# EAGLE design TestA (EAGLE 9.6.2)
IGNORE_RENUMBER: TP
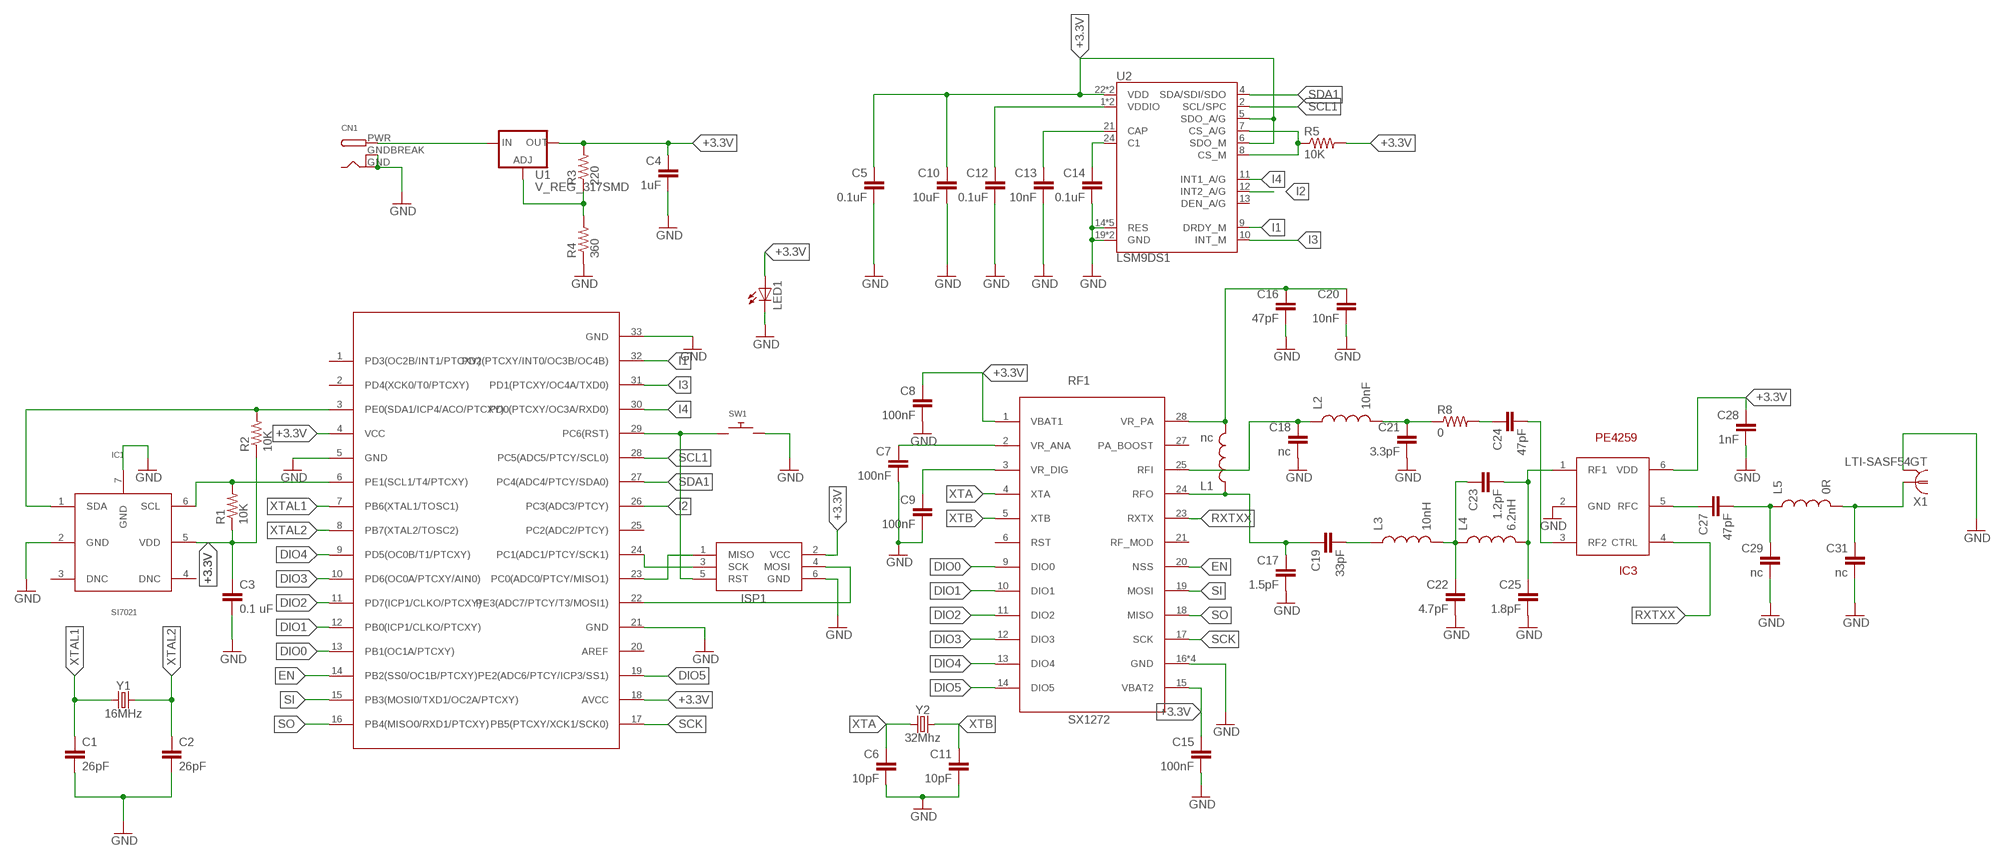
[diagram p0: schematic, sheet 1]

## Parts
C1  26pF  CAP0402-CAP  [0402-CAP]
C2  26pF  CAP0402-CAP  [0402-CAP]
C3  0.1 uF  CAP0402-CAP  [0402-CAP]
C4  1uF  CAP0402-CAP  [0402-CAP]
C5  0.1uF  CAP0402-CAP  [0402-CAP]
C6  10pF  CAP0402-CAP  [0402-CAP]
C7  100nF  CAP0402-CAP  [0402-CAP]
C8  100nF  CAP0402-CAP  [0402-CAP]
C9  100nF  CAP0402-CAP  [0402-CAP]
C10  10uF  CAP0402-CAP  [0402-CAP]
C11  10pF  CAP0402-CAP  [0402-CAP]
C12  0.1uF  CAP0402-CAP  [0402-CAP]
C13  10nF  CAP0402-CAP  [0402-CAP]
C14  0.1uF  CAP0402-CAP  [0402-CAP]
C15  100nF  CAP0402-CAP  [0402-CAP]
C16  47pF  CAP0402-CAP  [0402-CAP]
C17  1.5pF  CAP0402-CAP  [0402-CAP]
C18  nc  CAP0402-CAP  [0402-CAP]
C19  33pF  CAP0402-CAP  [0402-CAP]
C20  10nF  CAP0402-CAP  [0402-CAP]
C21  3.3pF  CAP0402-CAP  [0402-CAP]
C22  4.7pF  CAP0402-CAP  [0402-CAP]
C23  1.2pF  CAP0402-CAP  [0402-CAP]
C24  47pF  CAP0402-CAP  [0402-CAP]
C25  1.8pF  CAP0402-CAP  [0402-CAP]
C27  47pF  CAP0402-CAP  [0402-CAP]
C28  1nF  CAP0402-CAP  [0402-CAP]
C29  nc  CAP0402-CAP  [0402-CAP]
C31  nc  CAP0402-CAP  [0402-CAP]
CN1  DCBARRELPTH  [DCJACK_2MM_PTH]
IC1  SI7021  [SI7021]
IC2  ATMEGA328-PB  [ATMEGA328-PB]
IC3  PE4259  [PE4259]
ISP1  AVRISP-6  [AVRISP]
L1  nc  INDUCTOR0402  [C0402]
L2  10nF  INDUCTOR0402  [C0402]
L3  10nH  INDUCTOR0402  [C0402]
L4  6.2nH  INDUCTOR0402  [C0402]
L5  0R  INDUCTOR0402  [C0402]
LED1  LED3MM  [LED3MM]
R1  10K  RESISTOR0402-RES  [0402-RES]
R2  10K  RESISTOR0402-RES  [0402-RES]
R3  220  RESISTOR0402-RES  [0402-RES]
R4  360  RESISTOR0402-RES  [0402-RES]
R5  10K  RESISTOR0402-RES  [0402-RES]
R8  0  RESISTOR0402-RES  [0402-RES]
RF1  SX1272  [SX1272]
SW1  SWITCH_PUSHBUTTONSOFTTOUCHSMD_SJ  [PUSHBUTTON_SMD_SJ]
U1  V_REG_317SMD  [SOT223]
U2  LSM9DS1  [LGA24-8X4]
X1  LTI-SASF54GT  [LTI-SASF54GT]
Y1  16MHz  CRYSTAL-16MHZSMD-2X1.6  [CRYSTAL-SMD-2.0X1.6MM]
Y2  32Mhz  CRYSTAL-16MHZSMD-2X1.6  [CRYSTAL-SMD-2.0X1.6MM]

## Nets
+3.3V: C3.1 C4.1 C5.1 C8.1 C10.1 C15.1 C28.1 IC1.5(VDD) IC2.4(VCC) IC2.18(AVCC) IC3.6(VDD) ISP1.2(VCC) LED1.A R1.1 R2.1 R3.2 R5.2 RF1.1(VBAT1) RF1.15(VBAT2) U1.2(OUT) U2.5(SDO_A/G) U2.6(SDO_M) U2.22(VDD) U2.23(VDD)
DIO0: IC2.13(PB1(OC1A/PTCXY)) RF1.9(DIO0)
DIO1: IC2.12(PB0(ICP1/CLKO/PTCXY)) RF1.10(DIO1)
DIO2: IC2.11(PD7(ICP1/CLKO/PTCXY)) RF1.11(DIO2)
DIO3: IC2.10(PD6(OC0A/PTCXY/AIN0)) RF1.12(DIO3)
DIO4: IC2.9(PD5(OC0B/T1/PTCXY)) RF1.13(DIO4)
DIO5: IC2.19(PE2(ADC6/PTCY/ICP3/SS1)) RF1.14(DIO5)
EN: IC2.14(PB2(SS0/OC1B/PTCXY)) RF1.20(NSS)
GND: C1.2 C2.2 C3.2 C4.2 C5.2 C6.2 C7.2 C8.2 C9.2 C10.2 C11.2 C12.2 C13.2 C14.2 C15.2 C16.2 C17.2 C18.2 C20.2 C21.2 C22.2 C25.2 C28.2 C29.2 C31.2 CN1.GND CN1.GNDBREAK IC1.2(GND) IC1.7(GND) IC2.5(GND) IC2.21(GND) IC2.33(GND) IC3.2(GND) ISP1.6(GND) LED1.K(C) R4.1 RF1.16(GND) RF1.22(GND) RF1.26(GND) RF1.29(GND) SW1.P$2 U2.14(RES) U2.15(RES) U2.16(RES) U2.17(RES) U2.18(RES) U2.19(GND) U2.20(GND) X1.2 X1.3 X1.4 X1.5
I1: IC2.32(PD2(PTCXY/INT0/OC3B/OC4B)) U2.9(DRDY_M)
I2: IC2.26(PC3(ADC3/PTCY)) U2.12(INT2_A/G)
I3: IC2.31(PD1(PTCXY/OC4A/TXD0)) U2.10(INT_M)
I4: IC2.30(PD0(PTCXY/OC3A/RXD0)) U2.11(INT1_A/G)
N$1: C24.1 R8.2
N$2: C16.1 C20.1 L1.2 RF1.28(VR_PA)
N$3: CN1.PWR U1.3(IN)
N$4: C24.2 IC3.3(RF2)
N$5: R5.1 U2.7(CS_A/G) U2.8(CS_M)
N$6: R3.1 R4.2 U1.1(ADJ)
N$7: C18.1 L2.1 RF1.25(RFI)
N$8: C13.1 U2.21(CAP)
N$9: C12.1 U2.1(VDDIO) U2.3(VDDIO)
N$10: C21.1 L2.2 R8.1
N$11: C17.1 C19.1 L1.1 RF1.24(RFO)
N$12: C22.1 C23.1 L3.2 L4.1
N$13: C19.2 L3.1
N$14: C23.2 C25.1 IC3.1(RF1) L4.2
N$15: C31.1 L5.2 X1.1
N$16: C27.1 IC3.5(RFC)
N$17: C14.1 U2.24(C1)
N$18: C27.2 C29.1 L5.1
N$22: IC2.29(PC6(RST)) ISP1.5(RST) SW1.P$1
N$23: IC2.24(PC1(ADC1/PTCY/SCK1)) ISP1.3(SCK)
N$24: C7.1 RF1.2(VR_ANA)
N$25: C9.1 RF1.3(VR_DIG)
N$26: IC2.23(PC0(ADC0/PTCY/MISO1)) ISP1.1(MISO)
N$27: IC2.22(PE3(ADC7/PTCY/T3/MOSI1)) ISP1.4(MOSI)
RXTXX: IC3.4(CTRL) RF1.23(RXTX)
SCK: IC2.17(PB5(PTCXY/XCK1/SCK0)) RF1.17(SCK)
SCL: IC1.6(SCL) IC2.6(PE1(SCL1/T4/PTCXY)) R1.2
SCL1: IC2.28(PC5(ADC5/PTCY/SCL0)) U2.2(SCL/SPC)
SDA: IC1.1(SDA) IC2.3(PE0(SDA1/ICP4/ACO/PTCXY)) R2.2
SDA1: IC2.27(PC4(ADC4/PTCY/SDA0)) U2.4(SDA/SDI/SDO)
SI: IC2.15(PB3(MOSI0/TXD1/OC2A/PTCXY)) RF1.19(MOSI)
SO: IC2.16(PB4(MISO0/RXD1/PTCXY)) RF1.18(MISO)
XTA: C6.1 RF1.4(XTA) Y2.1
XTAL1: C1.1 IC2.7(PB6(XTAL1/TOSC1)) Y1.1
XTAL2: C2.1 IC2.8(PB7(XTAL2/TOSC2)) Y1.3
XTB: C11.1 RF1.5(XTB) Y2.3
Unconnected: IC1.3(DNC) IC1.4(DNC) IC2.1(PD3(OC2B/INT1/PTCXY)) IC2.2(PD4(XCK0/T0/PTCXY)) IC2.20(AREF) IC2.25(PC2(ADC2/PTCY)) RF1.6(RST) RF1.21(RF_MOD) RF1.27(PA_BOOST) U2.13(DEN_A/G)

## Library data of the parts
C1-C25 C27-C29 C31 = SparkFun:CAP: Capacitor Standard 0603 ceramic capacitor, and 0.1" leaded capacitor.
CN1 = adafruit:DCBARREL: 2.0mm DC Barrel Jack DCJACK_2MM_PTH - Through Hole Jack (4UConnector: 05537)
IC1 = Mini-Project:SI7021
IC2 = Mini-Project:ATMEGA328-PB
IC3 = Mini-Project:PE4259
ISP1 = adafruit:AVRISP: AVR ISP HEADER Standard 6 pin header for AVR programming
L1-L5 = SparkFun:INDUCTOR: Inductors Basic Inductor/Choke - 0603 and 1206. Footprints are not proven and vary greatly between part numbers.
LED1 = adafruit:LED: LED OSRAM: - CHIPLED LG R971, LG N971, LY N971, LG Q971, LY Q971, LO R971, LY R971 LH N974, LH R974 LS Q976, LO Q976, LY Q976 LO Q996 - Hyper CHIPLED LW Q18S LB Q993, LB Q99A, LB R99A - SideLED LS A670, LO A670, LY A670, LG A670, LP A670 LB A673, LV A673, LT A673, LW A673 LH A674 LY A675 LS A676, LA A676, LO A676, LY A676, LW A676 LS A679, LY A679, LG A679 - Hyper Micro SIDELED® LS Y876, LA Y876, LO Y876, LY Y876 LT Y87S - SmartLED LW L88C, LW L88S LB L89C, LB L89S, LG L890 LS L89K, LO L89K, LY L89K LS L896, LA L896, LO L896, LY L896 - TOPLED LS T670, LO T670, LY T670, LG T670, LP T670 LSG T670, LSP T670, LSY T670, LOP T670, LYG T670 LG T671, LOG T671, LSG T671 LB T673, LV T673, LT T673, LW T673 LH T674 LS T676, LA T676, LO T676, LY T676, LB T676, LH T676, LSB T676, LW T676 LB T67C, LV T67C, LT T67C, LS T67K, LO T67K, LY T67K, LW E67C LS E67B, LA E67B, LO E67B, LY E67B, LB E67C, LV E67C, LT E67C LW T67C LS T679, LY T679, LG T679 LS T770, LO T770, LY T770, LG T770, LP T770 LB T773, LV T773, LT T773, LW T773 LH T774 LS E675, LA E675, LY E675, LS T675 LS T776, LA T776, LO T776, LY T776, LB T776 LHGB T686 LT T68C, LB T68C - Hyper Mini TOPLED® LB M676 - Mini TOPLED Santana® LG M470 LS M47K, LO M47K, LY M47K Source: http://www.osram.convergy.de/
R1-R5 R8 = SparkFun:RESISTOR: Resistor Basic schematic elements and footprints for 0603, 1206, and PTH resistors.
RF1 = Mini-Project:SX1272
SW1 = adafruit:SWITCH_PUSHBUTTON: Buttons SOFTTOUCHSMD_SJ - Soft touch temporary push button (Super Junk Akihabara) Compatible with SKPMANE010 [Mouser: 688-SKPMAN] C&K_KSS = Digikey: KSS221GLFS
U1 = SparkFun:V_REG_317: Voltage Regulator Standard LM317 adjustable voltage regulator. AOI (Adjust Output Input). Google 'LM317 Calculator' for easy to use app to get the two resistor values needed. 240/720 for 5V output. 240/390 for 3.3V output. Spark Fun Electronics SKU : COM-00527
U2 = LSM9DS1:LSM9DS1: LSM9DS1 3D accelerometer, gyroscope & magnetometer The LSM9DS1 is a system-in-package featuring a 3D digital linear acceleration sensor, a 3D digital angular rate sensor, and a 3D digital magnetic sensor. The LSM9DS1 has a linear acceleration full scale of ±2g/±4g/±8/±16 g, a magnetic field full scale of ±4/±8/±12/±16 gauss and an angular rate of ±245/±500/±2000 dps. The LSM9DS1 includes an I2 C serial bus interface supporting standard and fast mode (100 kHz and 400 kHz) and an SPI serial standard interface. Magnetic, accelerometer and gyroscope sensing can be enabled or set in power-down mode separately for smart power management. The LSM9DS1 is available in a plastic land grid array package (LGA) and it is guaranteed to operate over an extended temperature range from -40 °C to +85 °C.; PROD_ID: IC-12536
X1 = con-coax:LTI-SASF54GT: SMA vertical PCB thrue hole jack Source: Lighthorse Technologies, inc. SASF54GT.pdf; OC_FARNELL: unknown; OC_NEWARK: unknown
Y1 = SparkFun-Clocks:CRYSTAL-16MHZ: 16MHz Crystal Digikey Example <http://www.digikey.com/product-search/en?keywords=535-9122-1-ND> Frequency: 16MHz Frequency Stability: ±50ppm Frequency Tolerance: ±20ppm Load Capacitance: 18pF SparkFun Products: Pro Micro -5V/16MHz <https://www.sparkfun.com/products/12640> SparkFun Serial Enabled LCD Kit <https://www.sparkfun.com/products/10097>; PROD_ID: XTAL-14681
Y2 = SparkFun-Clocks:CRYSTAL-16MHZ: 16MHz Crystal Digikey Example <http://www.digikey.com/product-search/en?keywords=535-9122-1-ND> Frequency: 16MHz Frequency Stability: ±50ppm Frequency Tolerance: ±20ppm Load Capacitance: 18pF SparkFun Products: Pro Micro -5V/16MHz <https://www.sparkfun.com/products/12640> SparkFun Serial Enabled LCD Kit <https://www.sparkfun.com/products/10097>; PROD_ID: XTAL-14681; VALUE: 16MHz

## Board
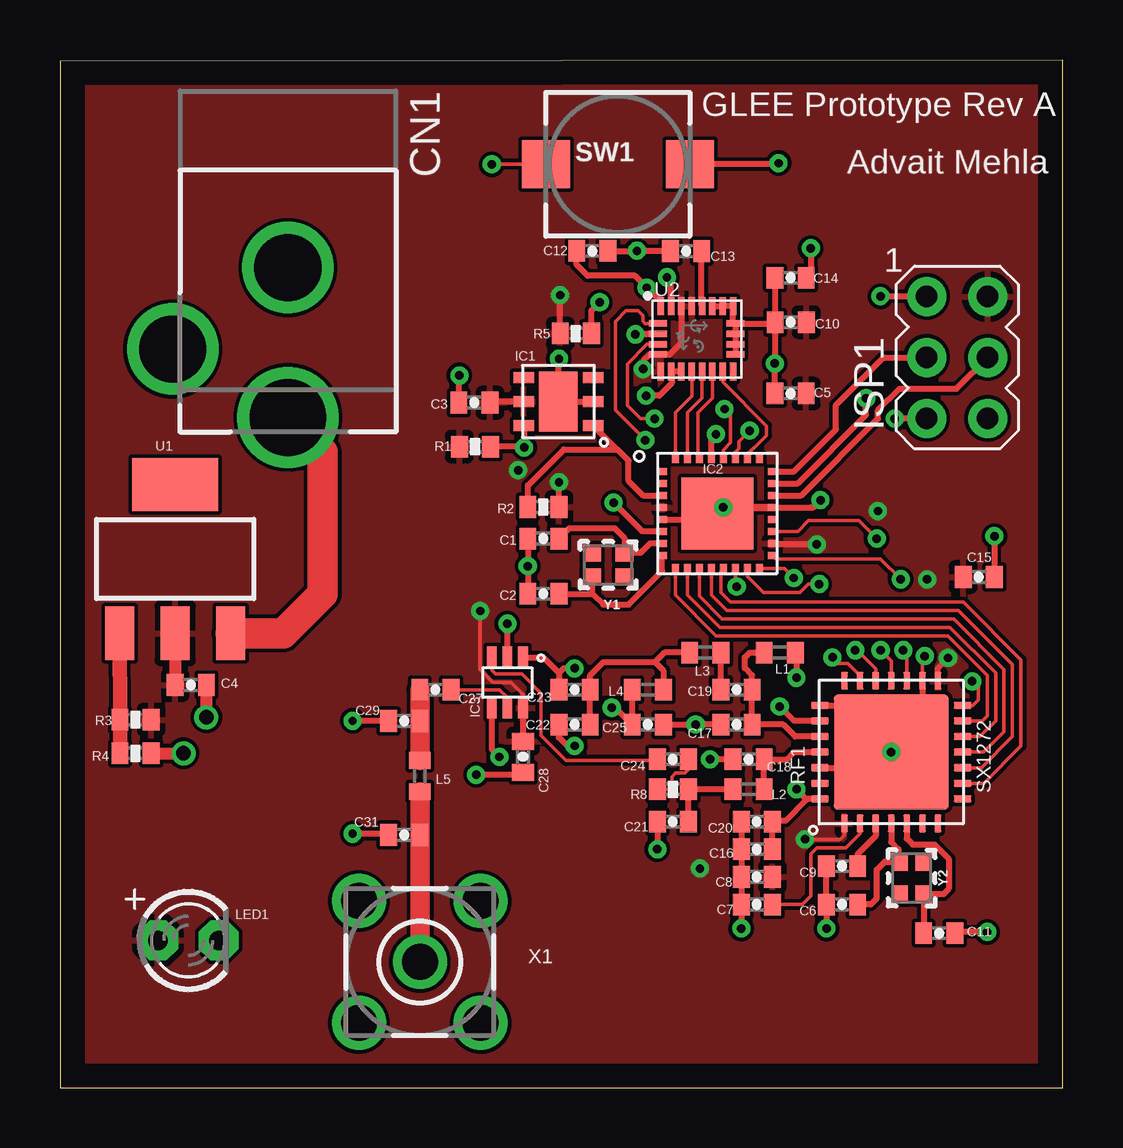
[diagram p1: board, top side]
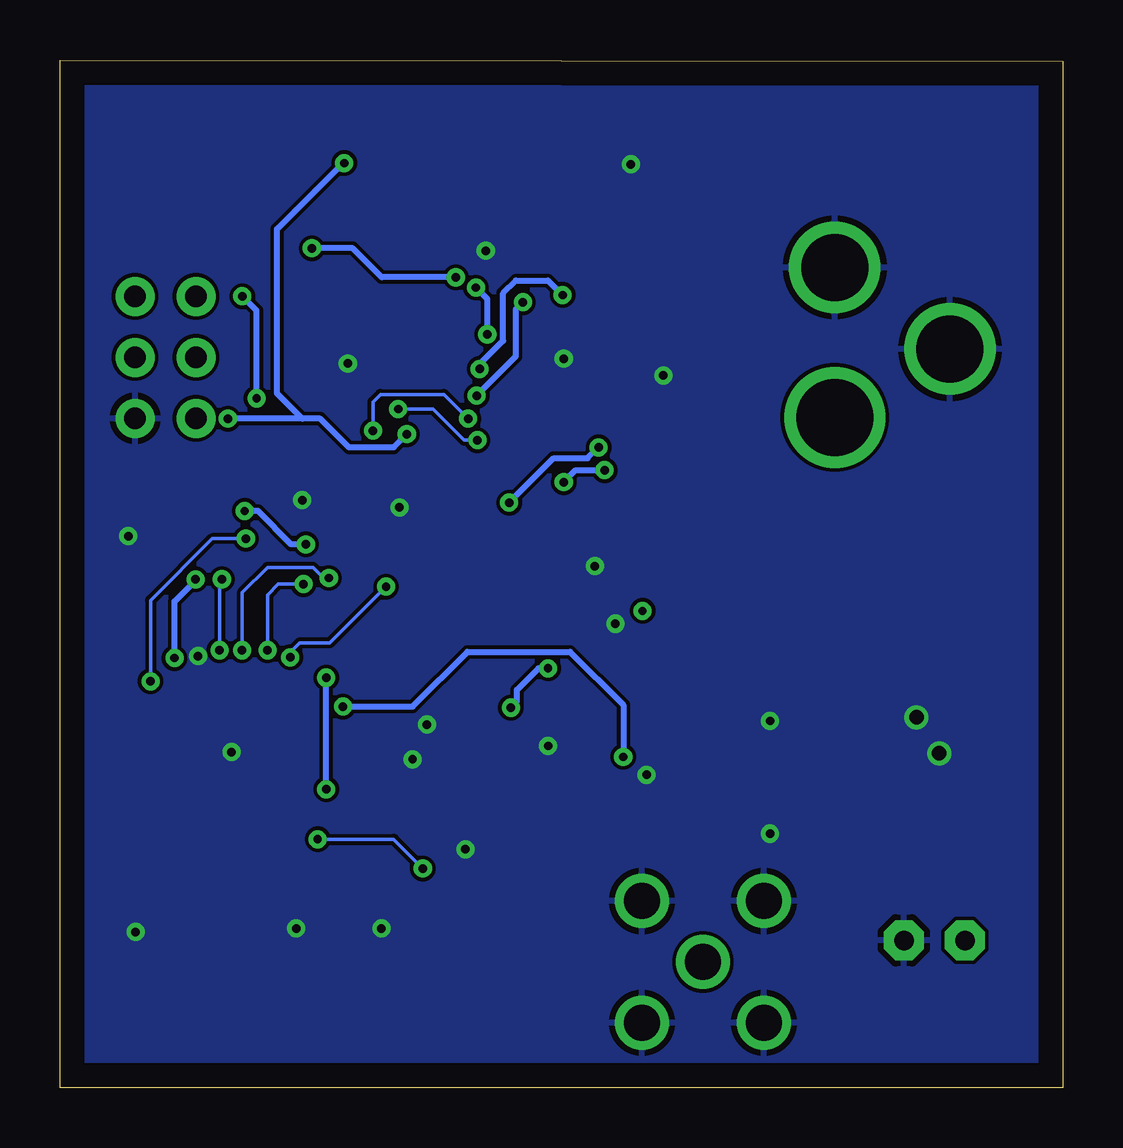
[diagram p2: board, bottom side, seen from below]

Size 41.8 x 42.85 mm. Coordinates in mm from the lower left corner, seen from the top.
Outline: 0,0 41.8,0 41.8,42.85 0,42.8 0,0
Copper layers (1*16): Top 0.035mm / dielectric 1.5mm / Bottom 0.035mm
Design rules "default": minimum track width 6mil, minimum drill 0.35mm, track to track 6mil, track to pad 6mil, pad to pad 6mil, via to via 6mil, smd to smd 6mil, copper to edge 40mil, drill to drill 6mil, minimum pad ring 10mil, minimum via ring 8mil, stop-mask expansion 4mil, vias tented up to drill 0mil, thermal gap 10mil

### Footprints (pad centres in the part's own frame; a part is rotated, then mirrored left to right if it is on the bottom)
0402-CAP = smd 0.7 x 0.9: 1 -0.65,0; 2 0.65,0
DCJACK_2MM_PTH = drill 2.8: GND 0,7.35; GNDBREAK 4.8,10.75 | drill 3.2: PWR 0,13.6
SI7021 = smd 0.85 x 0.45: 1 -1.45,1; 2 -1.45,0; 3 -1.45,-1; 4 1.45,-1; 5 1.45,0; 6 1.45,1 | smd 1.6 x 2.5: 7 0,0
ATMEGA328-PB = smd 0.4 x 0.3: 1 -2.3,1.75; 2 -2.3,1.25; 3 -2.3,0.75; 4 -2.3,0.25; 5 -2.3,-0.25; 6 -2.3,-0.75; 7 -2.3,-1.25; 8 -2.3,-1.75; 17 2.3,-1.75; 18 2.3,-1.25; 19 2.3,-0.75; 20 2.3,-0.25; 21 2.3,0.25; 22 2.3,0.75; 23 2.3,1.25; 24 2.3,1.75 | smd 0.3 x 0.4: 9 -1.75,-2.3; 10 -1.25,-2.3; 11 -0.75,-2.3; 12 -0.25,-2.3; 13 0.25,-2.3; 14 0.75,-2.3; 15 1.25,-2.3; 16 1.75,-2.3; 25 1.75,2.3; 26 1.25,2.3; 27 0.75,2.3; 28 0.25,2.3; 29 -0.25,2.3; 30 -0.75,2.3; 31 -1.25,2.3; 32 -1.75,2.3 | smd 3 x 3: 33 0,0
PE4259 = smd 0.4 x 0.9: 1 -0.65,-1.05; 2 0,-1.05; 3 0.65,-1.05; 4 0.65,1.05; 5 0,1.05; 6 -0.65,1.05
AVRISP = drill 0.9 pad 1.626: 1 -1.27,2.54; 2 1.27,2.54; 3 -1.27,0; 4 1.27,0; 5 -1.27,-2.54; 6 1.27,-2.54
C0402 = smd 0.7 x 0.9: 1 -0.65,0; 2 0.65,0
LED3MM = drill 0.813 pad 1.676 octagon: A -1.27,0; K 1.27,0
0402-RES = smd 0.7 x 0.9: 1 -0.65,0; 2 0.65,0
SX1272 = smd 0.75 x 0.3: 1 -2.975,1.95; 2 -2.975,1.3; 3 -2.975,0.65; 4 -2.975,0; 5 -2.975,-0.65; 6 -2.975,-1.3; 7 -2.975,-1.95; 15 2.975,-1.95; 16 2.975,-1.3; 17 2.975,-0.65; 18 2.975,0; 19 2.975,0.65; 20 2.975,1.3; 21 2.975,1.95 | smd 0.3 x 0.75: 8 -1.95,-2.975; 9 -1.3,-2.975; 10 -0.65,-2.975; 11 0,-2.975; 12 0.65,-2.975; 13 1.3,-2.975; 14 1.95,-2.975; 22 1.95,2.975; 23 1.3,2.975; 24 0.65,2.975; 25 0,2.975; 26 -0.65,2.975; 27 -1.3,2.975; 28 -1.95,2.975 | smd 4.8 x 4.8: 29 0,0
PUSHBUTTON_SMD_SJ = smd 2 x 2: P$1 3,0; P$2 -3,0
SOT223 = smd 1.219 x 2.235: 1 -2.311,-3.099; 2 0,-3.099; 3 2.311,-3.099 | smd 3.6 x 2.2: 4 0,3.099
LGA24-8X4 = smd 0.27 x 0.75: 1 -1.505,1.365; 6 -1.505,-1.365; 7 -1.075,-1.365; 8 -0.645,-1.365; 9 -0.215,-1.365; 10 0.215,-1.365; 11 0.645,-1.365; 12 1.075,-1.365; 13 1.505,-1.365; 18 1.505,1.365; 19 1.075,1.365; 20 0.645,1.365; 21 0.215,1.365; 22 -0.215,1.365; 23 -0.645,1.365; 24 -1.075,1.365 | smd 0.75 x 0.27: 2 -1.615,0.645; 3 -1.615,0.215; 4 -1.615,-0.215; 5 -1.615,-0.645; 14 1.615,-0.645; 15 1.615,-0.215; 16 1.615,0.215; 17 1.615,0.645
LTI-SASF54GT = drill 1.5 pad 2.2: 1 0,0; 2 -2.54,2.54; 3 2.54,2.54; 4 2.54,-2.54; 5 -2.54,-2.54
CRYSTAL-SMD-2.0X1.6MM = smd 0.75 x 0.7: 1 -0.675,-0.5; 2 0.675,-0.5; 3 0.675,0.5; 4 -0.675,0.5

### Placement (x,y rotation side)
C1  20.15,22.9 180 top
C2  20.15,20.6 180 top
C3  17.27,28.57 180 top
C4  5.45,16.8 0 top
C5  30.45,28.95 180 top
C6  32.6,7.65 180 top
C7  29.05,7.65 180 top
C8  29.05,8.8 180 top
C9  32.6,9.25 180 top
C10  30.46,31.91 180 top
C11  36.65,6.45 0 top
C12  22.19,34.89 0 top
C13  26.1,34.88 180 top
C14  30.45,33.77 180 top
C15  38.3,21.3 0 top
C16  29.05,9.95 180 top
C17  28.2,15.15 180 top
C18  28.7,13.7 180 top
C19  28.2,16.6 180 top
C20  29.05,11.1 180 top
C21  25.55,11.1 180 top
C22  21.45,15.15 180 top
C23  21.45,16.6 180 top
C24  25.55,13.7 180 top
C25  24.5,15.15 0 top
C27  15.65,16.6 180 top
C28  19.3,13.8 270 top
C29  14.35,15.3 180 top
C31  14.35,10.55 180 top
CN1  9.5,41.55 180 top
IC1  20.77,28.61 180 top
IC2  27.4,23.95 0 top
IC3  18.65,16.9 180 top
ISP1  37.4,30.45 0 top
L1  30,18.15 0 top
L2  28.7,12.45 180 top
L3  26.9,18.15 180 top
L4  24.5,16.6 180 top
L5  15,13 270 top
LED1  5.35,6.15 0 top
R1  17.3,26.73 0 top
R2  20.15,24.21 180 top
R3  3.15,15.35 0 top
R4  3.15,13.95 180 top
R5  21.5,31.45 180 top
R8  25.55,12.45 180 top
RF1  34.65,14 90 top
SW1  23.25,38.5 0 top
U1  4.8,22.05 0 top
U2  26.55,31.22 0 top
X1  15,5.25 0 top
Y1  22.85,21.8 180 top
Y2  35.5,8.75 270 top

### Tracks (layer width: path | path; a pad name or v marks a point on that pad's centre or on a via)
+3.3V  (via drill 0.35)
  Top 0.152: IC3.6 19.3,16.4 18.8,16.91 18.05,16.91 17.52,17.44 v17.52,19.88 | IC2.18 29.74,22.66 | RF1.1 32.7,10.53 32.54,10.37 v31.06,10.37
  Top 0.254: v24.3,29.97 24.3,30.3 24.59,30.57 U2.5 25.4,30.57 25.91,31.07 U2.23 | IC1.5 17.97,28.61 C3.1 | R2.1 v20.8,25.25 | v37.02,17.92 36.6,17.5 RF1.15 | IC3.6 C28.1 | v31.55,22.66 29.74,22.66 | R5.2 v20.85,33.05
  Top 0.508: U1.2 C4.1
  Bottom 0.152: v31.06,10.37 27.89,10.37 v26.68,9.15
  Bottom 0.254: v24.3,29.97 24.3,30.16 23.33,31.14 23.33,33.12 22.79,33.66 21.46,33.66 v20.85,33.05 | v20.8,25.25 20.3,25.75 v19.1,25.75 | v37.02,17.92 37.02,20.28 36.12,21.18 v36.15,21.2 | v31.55,22.66 32.16,22.66 33.55,24.05 v34.1,24.05
  pour Top: 0.4,42.55 41.65,42.55 41.65,0.48 24,0.45 14.06,0.47 0.4,0.47
DIO0
  Top 0.152: IC2.13 27.55,21.55 27.55,20.65 27.95,20.25 37.65,20.25 40.05,17.84 40.05,14.26 38.5,12.7 RF1.9
DIO1
  Top 0.152: IC2.12 27.15,20.55 27.8,19.9 37.45,19.9 39.7,17.65 39.7,14.65 38.4,13.35 RF1.10
DIO2
  Top 0.152: IC2.11 26.65,20.5 27.6,19.55 37.25,19.55 39.35,17.45 39.35,14.85 38.5,14 RF1.11
DIO3
  Top 0.152: IC2.10 26.15,20.55 27.5,19.2 37.1,19.2 39,17.3 39,15.3 38.35,14.65 RF1.12
DIO4
  Top 0.152: IC2.9 25.65,20.55 27.35,18.85 37,18.85 38.65,17.2 38.65,15.5 38.45,15.3 RF1.13
DIO5  (via drill 0.35)
  Top 0.152: IC2.19 30.75,23.2 31.2,23.65 33.3,23.65 v34.05,22.9 | v38.02,16.95 38.27,16.7 38.27,16.18 38.05,15.95 RF1.14
  Bottom 0.152: v38.02,16.95 38.02,20.32 35.45,22.9 v34.05,22.9
EN  (via drill 0.35)
  Top 0.152: IC2.14 28.15,20.96 v28.21,20.9 | v32.2,17.95 32.45,17.7 32.85,17.7 33.35,17.2 RF1.20
  Bottom 0.152: v28.21,20.9 30.56,18.55 31.8,18.55 32.2,18.15 v32.2,17.95
GND  (via drill 0.35, 0.6)
  Top 0.152: RF1.16 35.95,17.91 v36.05,18 | C28.2 19.2,13.05 | 35.95,15.3 RF1.29 | SW1.P$2 v18,38.5
  Top 0.254: U2.14 U2.15 U2.16 U2.17 | IC2.21 31.29,24.2 31.4,24.2 v31.7,24.5 | IC1.2 IC1.7 20.77,30.38 v20.8,30.4 | C3.2 16.62,29.68 v16.65,29.7 | U2.20 U2.19 U2.18 28.05,31.98 U2.17 | v19.5,21.75 C1.2 C2.2 | C9.2 C6.2 v31.95,6.65 | v28.4,6.65 C7.2 C8.2 C16.2 C20.2 | C18.2 v27.1,13.7 | C21.2 v24.9,9.95 | C17.2 v26.5,15.15 C25.2 | v38.65,6.5 37.35,6.5 C11.2 | IC3.2 v18.65,19.35 | 19.2,13.05 v17.35,13.05 | RF1.26 34,13.35 RF1.29 32.7,15.95 RF1.22 | RF1.16 35.95,15.3 | 29.75,29 C5.2 v29.8,30.2 v29.81,30.21 C10.2 | C12.2 v24.04,34.89 | v24.04,34.89 v24.05,34.9 | C13.2 24.05,34.88 v24.04,34.89 | C10.2 29.85,31.95 29.8,32.01 C14.2 | v21.45,14.26 21.15,14.26 20.8,14.61 C22.2 | v38.95,23 C15.2 | IC2.5 27.15,23.7 v27.65,24.2 | U2.17 29.76,31.86 C10.2 | C29.2 v12.2,15.3 | C31.2 13.65,10.6 v12.2,10.6
  Top 0.305: IC2.21 v27.65,24.2 IC2.33
  Top 0.508: R4.1 v5.15,13.95 | C4.2 v6.1,15.45
  other vias: 34.65,14
  pour Bottom: 0.4,42.6 41.65,42.6 41.65,0.5 23.7,0.45 0.4,0.5
I1
  Top 0.152: IC2.32 25.65,28.15 26.34,28.84 U2.9
I2
  Top 0.152: U2.12 27.62,29.43 29.45,27.6 29.45,27.2 28.93,26.68 28.91,26.68 28.65,26.42 IC2.26
I3
  Top 0.152: IC2.31 26.15,28.15 26.76,28.76 U2.10
I4
  Top 0.152: IC2.30 26.6,26.3 26.6,28.15 27.2,28.75 U2.11
N$1
  Top 0.152: R8.2 25.35,12.45 25.5,12.6 25.5,12.97 25.66,13.13 26.05,13.13 26.2,13.28 C24.1
N$2  (via drill 0.35)
  Top 0.152: L1.2 30.7,18.1
  Top 0.254: C16.1 C20.1 29.75,11.15 30.25,11.15 31.1,12 31.1,12.05 | RF1.28 31.1,12.05 | 31.1,12.05 v30.7,12.45 | 30.7,18.1 v30.7,17.1
  Bottom 0.254: v30.7,12.45 v30.7,17.1
N$3
  Top 1.27: CN1.PWR 10.95,26.5 10.95,20.59 9.31,18.95 U1.3
N$4
  Top 0.152: C24.2 24.85,13.65 21.1,13.65 20.05,14.7 20.05,16.45 19.25,17.25 18.15,17.25 18,17.4 IC3.3
N$5  (via drill 0.35 pad 0.55)
  Top 0.152: U2.7 25.51,29.82
  Top 0.254: U2.8 U2.7 | 25.51,29.82 25.51,29.39 24.98,28.86 v24.43,28.86 | R5.1 22.15,32.4 v22.5,32.75
  Bottom 0.254: v24.43,28.86 22.8,30.49 22.8,32.45 v22.5,32.75
N$6
  Top 0.61: U1.1 | U1.1 R3.1 R4.2
N$7
  Top 0.254: RF1.25 30.6,14 30.3,13.7 C18.1 L2.1
N$8
  Top 0.254: U2.21 26.75,32.6 C13.1
N$9  (via drill 0.35 pad 0.55)
  Top 0.152: 25.05,32.77 U2.1
  Top 0.254: 25.05,32.77 v24.46,33.36 23.96,33.86 22,33.86 21.54,34.31 C12.1 | U2.3 24.92,31.42 24.44,31.42 24.44,31.41 v23.98,31.41
  Bottom 0.254: v23.98,31.41 23.98,32.88 v24.46,33.36
N$10
  Top 0.254: L2.2 R8.1 C21.1
N$11
  Top 0.254: RF1.24 30.65,14.65 30.15,15.15 C17.1 C19.1 28.85,17.2 28.55,17.5 28.55,17.95 28.75,18.15 L1.1
N$12
  Top 0.254: C22.1 C23.1 22.1,17.2 22.65,17.75 24.8,17.75 | 24.8,17.75 25.15,17.4 L4.1 | L3.2 25.2,18.15 24.8,17.75
N$13
  Top 0.254: C19.2 L3.1
N$14  (via drill 0.35)
  Top 0.254: L4.2 C25.1 23.15,15.85 v23,15.85 | v21.45,17.49 20.99,17.49 20.8,17.3 | IC3.1 20.15,17.95 20.8,17.3 | 20.8,17.3 C23.2
  Bottom 0.152: v23,15.85 22.75,16.1
  Bottom 0.254: 22.75,16.1 22.75,16.6 21.86,17.49 v21.45,17.49
N$15
  Top 0.813: L5.2 C31.1 X1.1
N$16
  Top 0.152: IC3.5 18.63,15.87 18.63,16.3 18.32,16.6 C27.1
N$17  (via drill 0.35)
  Top 0.254: U2.24 25.48,33.62 v25.3,33.79 | v31.3,35 31.3,33.8 C14.1
  Bottom 0.254: v25.3,33.79 28.39,33.79 29.6,35 v31.3,35
N$18
  Top 0.813: C27.2 C29.1 L5.1
N$22  (via drill 0.35)
  Top 0.152: ISP1.5
  Top 0.254: IC2.29 27.15,27.06 v27.34,27.25 | ISP1.5 v34.8,27.9 | v29.95,38.55 29.9,38.5 SW1.P$1
  Bottom 0.152: 30,38.55 v29.95,38.55
  Bottom 0.254: v27.34,27.25 27.89,26.7 29.75,26.7 30.95,27.9 31.7,27.9 | 31.7,27.9 v34.8,27.9 | 31.7,27.9 32.75,28.95 32.75,35.8 30,38.55
N$23
  Top 0.254: IC2.24 30.6,25.7 32.35,27.45 32.35,28.47 34.33,30.45 ISP1.3
N$24
  Top 0.152: C7.1 30.95,7.65 31.3,8 31.3,9.75 31.55,10 32.75,10 33.35,10.6 RF1.2
N$25
  Top 0.254: RF1.3 34,10.5 33.25,9.75 C9.1
N$26  (via drill 0.35)
  Top 0.152: ISP1.1
  Top 0.254: IC2.23 30.75,25.2 33.6,28.05 v33.6,28.75 | v34.2,33 ISP1.1
  Bottom 0.254: v33.6,28.75 33.6,32.4 v34.2,33
N$27
  Top 0.254: IC2.22 30.9,24.7 34.1,27.9 34.1,28.25 35,29.15 37.37,29.15 ISP1.4
RXTXX  (via drill 0.35)
  Top 0.254: RF1.23 30.6,15.3 v30,15.9 | v18.32,13.8 18,14.12 IC3.4
  Bottom 0.254: v30,15.9 27.1,15.9 24.82,18.18 20.53,18.18 18.32,15.97 v18.32,13.8
SCK  (via drill 0.35)
  Top 0.152: IC2.17 29.85,22.05 34.21,22.05 v35.05,21.21 | v35.15,18.24 35.3,18.09 RF1.17
  Bottom 0.152: v35.05,21.21 35.15,21.11 v35.15,18.24
SCL  (via drill 0.35)
  Top 0.254: IC2.6 24.27,23.2 v23.07,24.4 | R1.2 19.32,26.73 v19.35,26.7 19.35,27.59 IC1.6
  Bottom 0.254: v23.07,24.4 21.23,26.25 19.8,26.25 v19.35,26.7
SCL1  (via drill 0.35)
  Top 0.152: U2.2 24.39,31.86 24.3,31.96 24.3,32.2 24.1,32.4 23.6,32.4 23.15,31.95 23.15,28.25 v24.4,27 | v27.7,28.3 27.95,28.05 27.95,26.9 27.65,26.6 IC2.28
  Bottom 0.152: v24.4,27 24.95,27 26.25,28.3 v27.7,28.3
SDA
  Top 0.254: IC2.3 24.3,24.7 23.7,25.3 23.7,26.15 23.23,26.61 | 23.23,26.61 21,26.61 19.5,25.11 R2.2 | 23.23,26.61 IC1.1
SDA1  (via drill 0.35)
  Top 0.152: U2.4 24.93,31 24.47,31 23.65,30.17 23.65,28.45 24.2,27.9 v24.79,27.9 | IC2.27 28.15,26.5 28.3,26.65 28.3,26.95 v28.75,27.4
  Bottom 0.152: v28.75,27.4 28.75,28.6 28.44,28.91 25.8,28.91 v24.79,27.9
SI  (via drill 0.35)
  Top 0.152: v33.15,18.24 33.23,18.24 34,17.48 RF1.19 | IC2.15 28.65,21.32 29.32,20.65 30.84,20.65 31.19,21 v31.65,21
  Bottom 0.152: v31.65,21 32.7,21 33.15,20.55 v33.15,18.24
SO  (via drill 0.35)
  Top 0.152: v30.59,21.26 30.2,21.65 IC2.16 | v34.21,18.24 34.65,17.8 RF1.18
  Bottom 0.152: v30.59,21.26 30.81,21.26 31.25,21.7 33.15,21.7 34.2,20.65 34.2,18.25 v34.21,18.24
XTA
  Top 0.152: 34.95,9.43 Y2.1
  Top 0.254: C6.1 33.8,7.65 34.05,7.9 34.05,9.1 34.38,9.43 Y2.1 34.92,9.35 | RF1.4 34.65,10.25 34.95,9.95 34.95,9.43
XTAL1
  Top 0.254: C1.1 21.23,23.32 23.12,23.32 23.52,22.93 Y1.1 24.2,22.3 24.6,22.7 IC2.7
XTAL2
  Top 0.254: IC2.8 25.1,21.55 23.7,20.15 22.65,20.15 22.2,20.6 22.18,20.6 | C2.1 22.18,20.6 | Y1.3 22.18,20.6
XTB
  Top 0.152: 36,8.05 Y2.3
  Top 0.254: RF1.5 35.3,10.4 35.55,10.15 36.45,10.15 37.05,9.55 37.05,8.3 36.83,8.07 Y2.3 C11.1

### Text on the board
tPlace: GLEE Prototype Rev A | Advait Mehla